# Altium schematic sheet InstrumentCluster.SchDoc
size A4
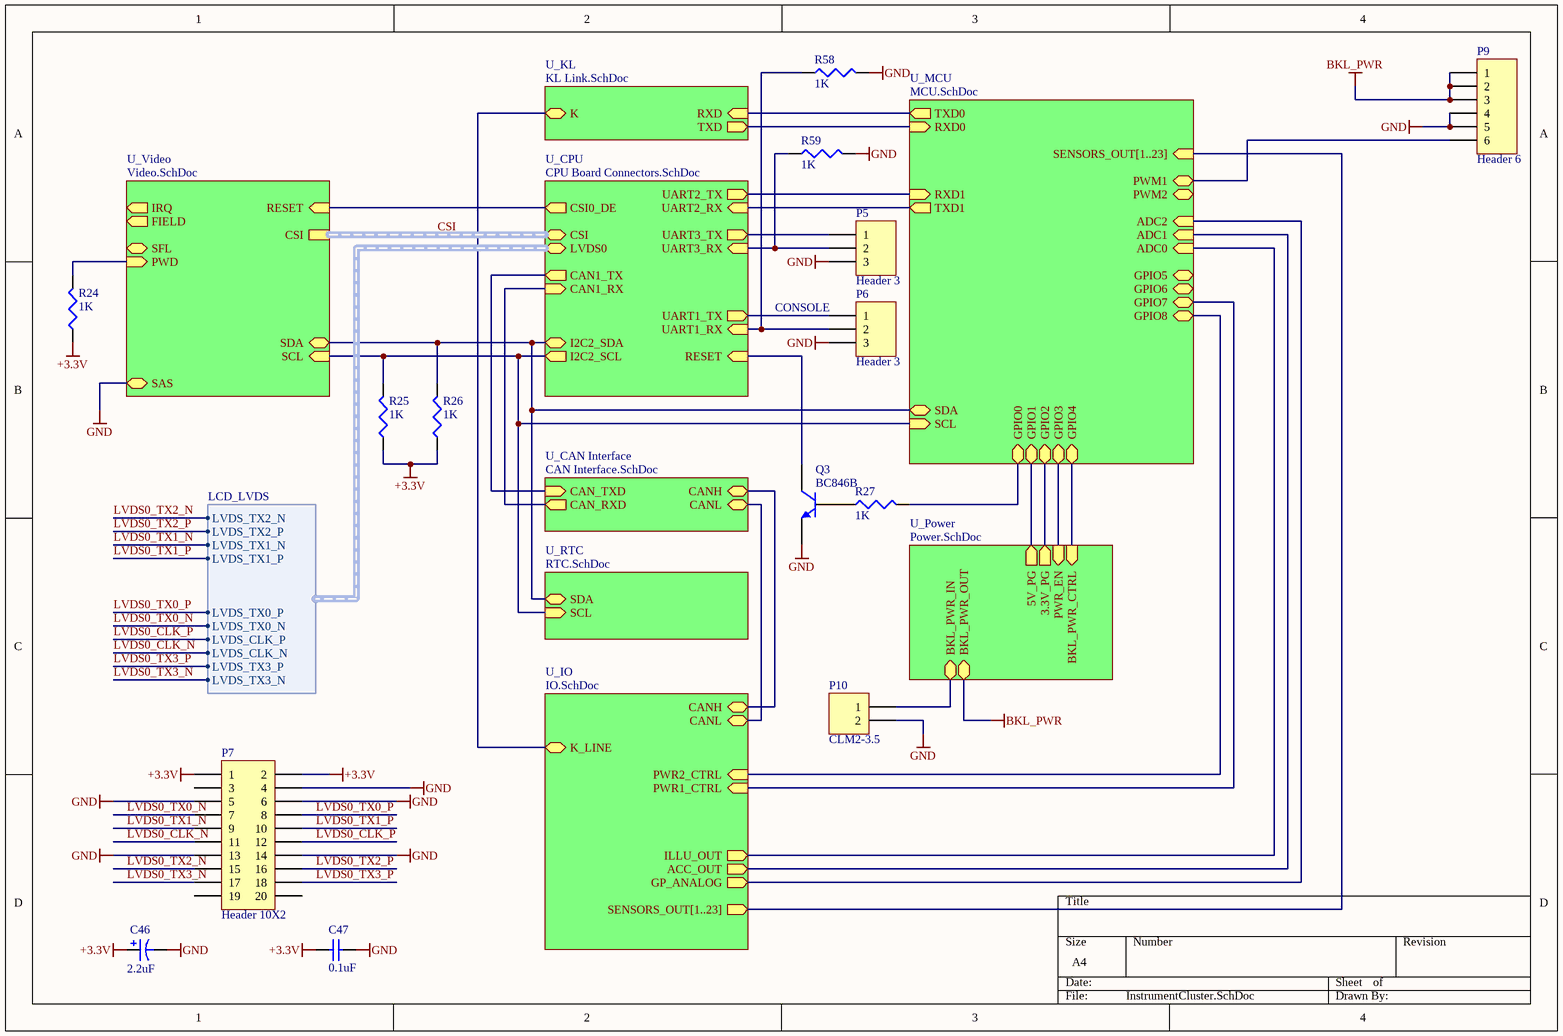
[diagram p0: InstrumentCluster.SchDoc]

## Parts
C46  2.2uF  [6032]
C47  0.1uF  [2012[0805]]
P5  Header 3  [HDR1X3]
P6  Header 3  [HDR1X3]
P7  Header 10X2  [HDR2X10]
P9  Header 6  [HDR1X6]
P10  CLM2-3.5  [CLM2-3.5]
Q3  BC846B  [SOT23_N]
R24  1K  [R2012[0805]]
R25  1K  [R2012[0805]]
R26  1K  [R2012[0805]]
R27  1K  [R2012[0805]]
R58  1K  [R2012[0805]]
R59  1K  [R2012[0805]]

## Sub-sheets
U_CAN Interface = CAN Interface.SchDoc: CAN_TXD (in), CAN_RXD (out), CANH (bidir), CANL (bidir)
U_CPU = CPU Board Connectors.SchDoc: CSI (harness CSI), CAN1_TX (out), CAN1_RX (in), I2C2_SDA (bidir), I2C2_SCL (out), UART2_TX (out), UART2_RX (in), UART3_RX (in), UART1_RX (in), UART3_TX (out), UART1_TX (out), RESET (in), LVDS0 (harness LCD_LVDS), CSI0_DE (out)
U_IO = IO.SchDoc: ILLU_OUT (out), ACC_OUT (out), K_LINE (bidir), CANH (bidir), CANL (bidir), PWR1_CTRL (in), PWR2_CTRL (in), GP_ANALOG (out), SENSORS_OUT[1..23] (out)
U_KL = KL Link.SchDoc: K (bidir), RXD (in), TXD (out)
U_MCU = MCU.SchDoc: PWM1 (bidir), SDA (bidir), SCL (in), GPIO5 (bidir), RXD1 (in), TXD1 (out), TXD0 (out), RXD0 (in), ADC1 (in), ADC0 (in), PWM2 (bidir), ADC2 (in), GPIO6 (bidir), GPIO7 (bidir), GPIO8 (bidir), SENSORS_OUT[1..23] (in), GPIO0 (bidir), GPIO1 (bidir), GPIO2 (bidir), GPIO3 (bidir), GPIO4 (bidir)
U_Power = Power.SchDoc: 3.3V_PG (out), 5V_PG (out), PWR_EN (in), BKL_PWR_CTRL (in), BKL_PWR_IN, BKL_PWR_OUT
U_RTC = RTC.SchDoc: SCL (in), SDA (bidir)
U_Video = Video.SchDoc: RESET (in), IRQ (out), FIELD (out), CSI (harness CSI), SFL (bidir), PWD (in), SCL (in), SDA (bidir), SAS

## Harnesses
LCD_LVDS: LVDS_TX0_P, LVDS_TX0_N, LVDS_TX1_P, LVDS_TX1_N, LVDS_TX2_P, LVDS_TX2_N, LVDS_CLK_P, LVDS_CLK_N, LVDS_TX3_P, LVDS_TX3_N

## Nets
+3.3V: C46.1 C47.2 P7.1 P7.2 R24.1 R25.1 R26.1
BKL_PWR: P9.1 P9.2 P9.3 ; sheet U_Power/BKL_PWR_OUT
GND: C46.2 C47.1 P5.3 P6.3 P7.4 P7.5 P7.6 P7.13 P7.14 P9.4 P9.5 P10.2 Q3.2(E) R58.2 R59.2 ; sheet U_Video/SAS
LVDS0_CLK_N: P7.11 ; sheet U_CPU/LVDS0.LVDS_CLK_N
LVDS0_CLK_P: P7.12 ; sheet U_CPU/LVDS0.LVDS_CLK_P
LVDS0_TX0_N: P7.7 ; sheet U_CPU/LVDS0.LVDS_TX0_N
LVDS0_TX0_P: P7.8 ; sheet U_CPU/LVDS0.LVDS_TX0_P
LVDS0_TX1_N: P7.9 ; sheet U_CPU/LVDS0.LVDS_TX1_N
LVDS0_TX1_P: P7.10 ; sheet U_CPU/LVDS0.LVDS_TX1_P
LVDS0_TX2_N: P7.15 ; sheet U_CPU/LVDS0.LVDS_TX2_N
LVDS0_TX2_P: P7.16 ; sheet U_CPU/LVDS0.LVDS_TX2_P
LVDS0_TX3_N: P7.17 ; sheet U_CPU/LVDS0.LVDS_TX3_N
LVDS0_TX3_P: P7.18 ; sheet U_CPU/LVDS0.LVDS_TX3_P
NetP5_1: P5.1 ; sheet U_CPU/UART3_TX
NetP5_2: P5.2 R59.1 ; sheet U_CPU/UART3_RX
NetP6_1: P6.1 ; sheet U_CPU/UART1_TX
NetP6_2: P6.2 R58.1 ; sheet U_CPU/UART1_RX
NetP9_6: P9.6 ; sheet U_MCU/PWM1
NetP10_1: P10.1 ; sheet U_Power/BKL_PWR_IN
NetQ3_1: Q3.1(B) R27.1
NetQ3_3: Q3.3(C) ; sheet U_CPU/RESET
NetR24_2: R24.2 ; sheet U_Video/PWD
NetR25_2: R25.2 ; sheet U_Video/SCL, sheet U_CPU/I2C2_SCL, sheet U_MCU/SCL, sheet U_RTC/SCL
NetR26_2: R26.2 ; sheet U_Video/SDA, sheet U_CPU/I2C2_SDA, sheet U_MCU/SDA, sheet U_RTC/SDA
NetR27_2: R27.2 ; sheet U_MCU/GPIO0
(unnamed): sheet U_Power/3.3V_PG, sheet U_MCU/GPIO2
(unnamed): sheet U_Power/5V_PG, sheet U_MCU/GPIO1
(unnamed): sheet U_Power/PWR_EN, sheet U_MCU/GPIO3
(unnamed): sheet U_Power/BKL_PWR_CTRL, sheet U_MCU/GPIO4
(unnamed): sheet U_Video/RESET, sheet U_CPU/CSI0_DE
(unnamed): sheet U_CPU/CAN1_TX, sheet U_CAN Interface/CAN_TXD
(unnamed): sheet U_CPU/CAN1_RX, sheet U_CAN Interface/CAN_RXD
(unnamed): sheet U_CPU/UART2_TX, sheet U_MCU/RXD1
(unnamed): sheet U_CPU/UART2_RX, sheet U_MCU/TXD1
(unnamed): sheet U_MCU/TXD0, sheet U_KL/RXD
(unnamed): sheet U_MCU/RXD0, sheet U_KL/TXD
(unnamed): sheet U_MCU/ADC1, sheet U_IO/ACC_OUT
(unnamed): sheet U_MCU/ADC0, sheet U_IO/ILLU_OUT
(unnamed): sheet U_MCU/ADC2, sheet U_IO/GP_ANALOG
(unnamed): sheet U_MCU/GPIO7, sheet U_IO/PWR1_CTRL
(unnamed): sheet U_MCU/GPIO8, sheet U_IO/PWR2_CTRL
(unnamed): sheet U_CAN Interface/CANH, sheet U_IO/CANH
(unnamed): sheet U_CAN Interface/CANL, sheet U_IO/CANL
(unnamed): sheet U_KL/K, sheet U_IO/K_LINE

Not connected (* = marked no-connect by the designer): P7 3 19 20

## Buses and harness runs
bus sheet U_IO/SENSORS_OUT[1..23] = sheet U_MCU/SENSORS_OUT[1..23]
harness CSI = sheet U_CPU/CSI = sheet U_Video/CSI

## Notes on the sheet
- CONSOLE

## Library data of the parts
C46 = 893D225X0025C2: Tantamount Built-In-Fuse Miniature, Molded-Case Solid Tantalum Chip Capacitor: 2.2uF, 20% Tolerance, 25 WVDC @ +85°C, Surge = 32V; Note: See Data Sheet for full range of components; Published: 19-Mar-2004; DatasheetDocument: 04-Feb-2003; PackageReference: 6032; Publisher: Altium Limited; Code_JEITA: 6032; ComponentLink1Description: Manufacturer Link; ComponentLink1URL: http://www.vishay.com/; ComponentLink2Description: Datasheet; ComponentLink2URL: http://www.vishay.com/docs/40008/893d.pdf; Value: 2.2uF
C47 = C0805: Ceramic Chip Capacitor - Standard; Note: Footprint corresponds to dimensions for bulk cassette packaging. This case size has tightened tolerances.; Published: 17-Jul-2002; LatestRevisionDate: 19-Mar-2004; LatestRevisionNote: Silkscreen size reduced.; DatasheetDocument: Mar-2001; PackageDocument: Mar-2001; PackageReference: 0805; Publisher: Altium Limited; Code_JEITA: 0805; Code_IPC: 2012[0805]; ComponentLink1Description: Manufacturer Link; ComponentLink1URL: http://www.kemet.com/; ComponentLink2Description: Datasheet; ComponentLink2URL: http://www.kemet.com/kemet/web/homepage/kechome.nsf/vapubfilesname/F3102TA.pdf/$file/F3102TA.pdf; Value: 0.1uF
P5 P6 = Header 3: Header, 3-Pin; LatestRevisionDate: 17-Jul-2002; LatestRevisionNote: Re-released for DXP Platform.; Publisher: Altium Limited
P7 = Header 10X2: Header, 10-Pin, Dual row; LatestRevisionDate: 17-Jul-2002; LatestRevisionNote: Re-released for DXP Platform.; Publisher: Altium Limited
P9 = Header 6: Header, 6-Pin; LatestRevisionDate: 17-Jul-2002; LatestRevisionNote: Re-released for DXP Platform.; Publisher: Altium Limited
Q3 = BC846B: NPN General-purpose Transistor; Published: 17-Sep-2003; LatestRevisionDate: 12-Dec-2006; LatestRevisionNote: IPC-7351 Footprint Added.; DatasheetVersion: 4-Feb-2002; PackageVersion: May-1999; PackageReference: SOT23; Publisher: Altium Limited; PackageDescription: 3-Pin SOT-23 Package 0.95 mm Pitch, 2.3 mm Lead Span; ComponentLink1Description: Manufacturer Link; ComponentLink1URL: http://www.semiconductors.philips.com/; ComponentLink2Description: Datasheet; ComponentLink2URL: http://www.semiconductors.philips.com/acrobat/datasheets/BC846_BC847_BC848_5.pdf
R24-R27 R58 R59 = R0805: Published: 8-Jun-2000; LatestRevisionDate: 29-May-2009; LatestRevisionNote: IPC-7351 Footprint Added.; PackageReference: J1-0603; Publisher: Altium Limited; PackageDescription: Chip Resistor; Value: 1K